# Altium schematic sheet MCU.SchDoc
size A4; SheetNumber: 2; SheetTotal: 8
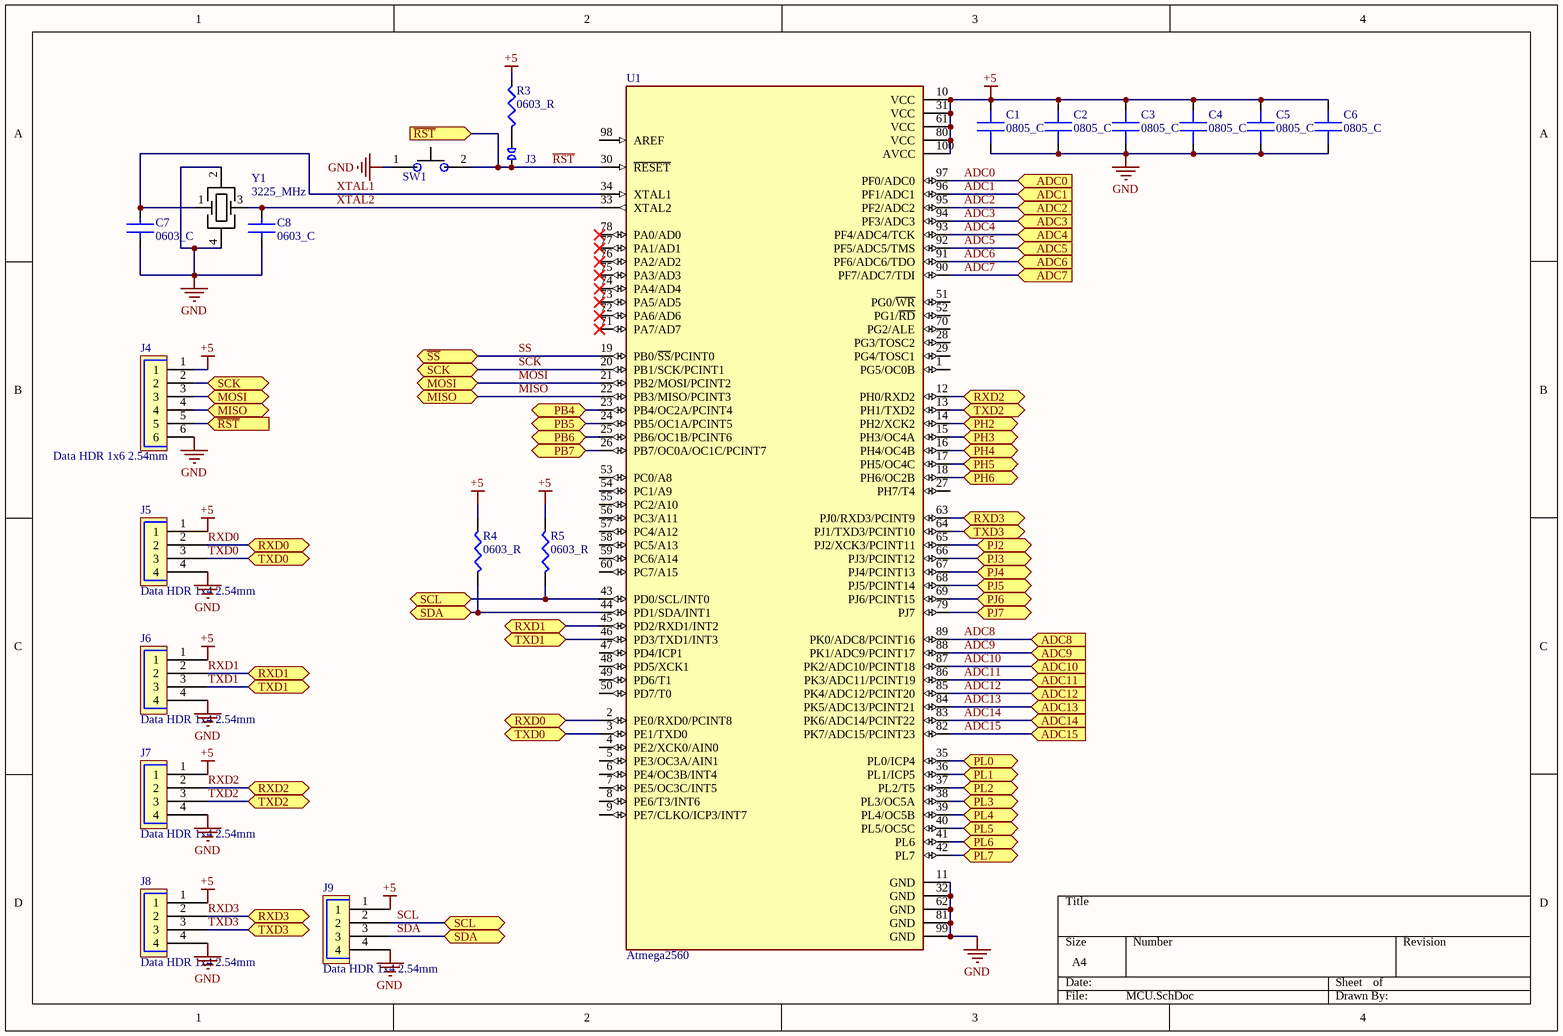
[diagram p0: MCU.SchDoc]

## Parts
C1  0805_C  [C0805 - 0.1uf]
C2  0805_C  [C0805 - 0.1uf]
C3  0805_C  [C0805 - 0.1uf]
C4  0805_C  [C0805 - 0.1uf]
C5  0805_C  [C0805 - 0.1uf]
C6  0805_C  [C0805 - 0.1uf]
C7  0603_C  [0603_CAP]
C8  0603_C  [0603_CAP]
J3  Jumper Pads  [JMP]  (value not drawn)
J4  Data HDR 1x6 2.54mm  [DHDR_1x6_2.54mm]
J5  Data HDR 1x4 2.54mm  [DHDR_1x4_2.54mm]
J6  Data HDR 1x4 2.54mm  [DHDR_1x4_2.54mm]
J7  Data HDR 1x4 2.54mm  [DHDR_1x4_2.54mm]
J8  Data HDR 1x4 2.54mm  [DHDR_1x4_2.54mm]
J9  Data HDR 1x4 2.54mm  [DHDR_1x4_2.54mm]
R3  0603_R  [0603_CAP]
R4  0603_R  [0603_CAP]
R5  0603_R  [0603_CAP]
SW1  2*3*4 SMD Button 2_Pads  [2padSMD- 2*3*4]  (value not drawn)
U1  Atmega2560  [QFP50P1600X1600X120-100N]
Y1  3225_MHz  [3225_Crystal]

## Ports
ADC0 (in), ADC1 (in), ADC2 (in), ADC3 (in), ADC4 (in), ADC5 (in), ADC6 (in), ADC7 (in), ADC8 (in), ADC9 (in), ADC10 (in), ADC11 (in), ADC12 (in), ADC13 (in), ADC14 (in), ADC15 (in), MISO (bidir), MOSI (bidir), PB4 (bidir), PB5 (bidir), PB6 (bidir), PB7 (bidir), PH2 (bidir), PH3 (bidir), PH4 (bidir), PH5 (bidir), PH6 (bidir), PJ2 (bidir), PJ3 (bidir), PJ4 (bidir), PJ5 (bidir), PJ6 (bidir), PJ7 (bidir), PL0 (bidir), PL1 (bidir), PL2 (bidir), PL3 (bidir), PL4 (bidir), PL5 (bidir), PL6 (bidir), PL7 (bidir), RXD0 (bidir), RXD1 (bidir), RXD2 (bidir), RXD3 (bidir), SCK (bidir), SCL (bidir), SDA (bidir), TXD0 (bidir), TXD1 (bidir), TXD2 (bidir), TXD3 (bidir), ~{RST} (in), ~{SS} (bidir)

## Nets
+5: C1.2 C2.2 C3.2 C4.2 C5.2 C6.2 J4.1 J5.1 J6.1 J7.1 J8.1 J9.1 R3.2 R4.2 R5.2 U1.10(VCC) U1.31(VCC) U1.61(VCC) U1.80(VCC) U1.100(AVCC)
GND: C1.1 C2.1 C3.1 C4.1 C5.1 C6.1 C7.1 C8.1 J4.6 J5.4 J6.4 J7.4 J8.4 J9.4 SW1.1 U1.11(GND) U1.32(GND) U1.62(GND) U1.81(GND) U1.99(GND) Y1.2 Y1.4
ADC0: U1.97(PF0/ADC0) ; port ADC0
ADC1: U1.96(PF1/ADC1) ; port ADC1
ADC2: U1.95(PF2/ADC2) ; port ADC2
ADC3: U1.94(PF3/ADC3) ; port ADC3
ADC4: U1.93(PF4/ADC4/TCK) ; port ADC4
ADC5: U1.92(PF5/ADC5/TMS) ; port ADC5
ADC6: U1.91(PF6/ADC6/TDO) ; port ADC6
ADC7: U1.90(PF7/ADC7/TDI) ; port ADC7
ADC8: U1.89(PK0/ADC8/PCINT16) ; port ADC8
ADC9: U1.88(PK1/ADC9/PCINT17) ; port ADC9
ADC10: U1.87(PK2/ADC10/PCINT18) ; port ADC10
ADC11: U1.86(PK3/ADC11/PCINT19) ; port ADC11
ADC12: U1.85(PK4/ADC12/PCINT20) ; port ADC12
ADC13: U1.84(PK5/ADC13/PCINT21) ; port ADC13
ADC14: U1.83(PK6/ADC14/PCINT22) ; port ADC14
ADC15: U1.82(PK7/ADC15/PCINT23) ; port ADC15
MISO: J4.4 U1.22(PB3/MISO/PCINT3) ; port MISO
MOSI: J4.3 U1.21(PB2/MOSI/PCINT2) ; port MOSI
PB4: U1.23(PB4/OC2A/PCINT4) ; port PB4
PB5: U1.24(PB5/OC1A/PCINT5) ; port PB5
PB6: U1.25(PB6/OC1B/PCINT6) ; port PB6
PB7: U1.26(PB7/OC0A/OC1C/PCINT7) ; port PB7
PH2: U1.14(PH2/XCK2) ; port PH2
PH3: U1.15(PH3/OC4A) ; port PH3
PH4: U1.16(PH4/OC4B) ; port PH4
PH5: U1.17(PH5/OC4C) ; port PH5
PH6: U1.18(PH6/OC2B) ; port PH6
PJ2: U1.65(PJ2/XCK3/PCINT11) ; port PJ2
PJ3: U1.66(PJ3/PCINT12) ; port PJ3
PJ4: U1.67(PJ4/PCINT13) ; port PJ4
PJ5: U1.68(PJ5/PCINT14) ; port PJ5
PJ6: U1.69(PJ6/PCINT15) ; port PJ6
PJ7: U1.79(PJ7) ; port PJ7
PL0: U1.35(PL0/ICP4) ; port PL0
PL1: U1.36(PL1/ICP5) ; port PL1
PL2: U1.37(PL2/T5) ; port PL2
PL3: U1.38(PL3/OC5A) ; port PL3
PL4: U1.39(PL4/OC5B) ; port PL4
PL5: U1.40(PL5/OC5C) ; port PL5
PL6: U1.41(PL6) ; port PL6
PL7: U1.42(PL7) ; port PL7
~{RST}: J3.1 J4.5 SW1.2 U1.30(~{RESET}) ; port ~{RST}
RXD0: J5.2 U1.2(PE0/RXD0/PCINT8) ; port RXD0
RXD1: J6.2 U1.45(PD2/RXD1/INT2) ; port RXD1
RXD2: J7.2 U1.12(PH0/RXD2) ; port RXD2
RXD3: J8.2 U1.63(PJ0/RXD3/PCINT9) ; port RXD3
SCK: J4.2 U1.20(PB1/SCK/PCINT1) ; port SCK
SCL: J9.2 R5.1 U1.43(PD0/SCL/INT0) ; port SCL
SDA: J9.3 R4.1 U1.44(PD1/SDA/INT1) ; port SDA
SS: U1.19(PB0/~{SS}/PCINT0) ; port ~{SS}
TXD0: J5.3 U1.3(PE1/TXD0) ; port TXD0
TXD1: J6.3 U1.46(PD3/TXD1/INT3) ; port TXD1
TXD2: J7.3 U1.13(PH1/TXD2) ; port TXD2
TXD3: J8.3 U1.64(PJ1/TXD3/PCINT10) ; port TXD3
XTAL1: C7.2 U1.34(XTAL1) Y1.1
XTAL2: C8.2 U1.33(XTAL2) Y1.3
NetJ3_2: J3.2 R3.1

Not connected (* = marked no-connect by the designer): U1 1(PG5/OC0B) 4(PE2/XCK0/AIN0) 5(PE3/OC3A/AIN1) 6(PE4/OC3B/INT4) 7(PE5/OC3C/INT5) 8(PE6/T3/INT6) 9(PE7/CLKO/ICP3/INT7) 27(PH7/T4) 28(PG3/TOSC2) 29(PG4/TOSC1) 47(PD4/ICP1) 48(PD5/XCK1) 49(PD6/T1) 50(PD7/T0) 51(PG0/~{WR}) 52(PG1/~{RD}) 53(PC0/A8) 54(PC1/A9) 55(PC2/A10) 56(PC3/A11) 57(PC4/A12) 58(PC5/A13) 59(PC6/A14) 60(PC7/A15) 70(PG2/ALE) 71(PA7/AD7)* 72(PA6/AD6)* 73(PA5/AD5)* 74(PA4/AD4)* 75(PA3/AD3)* 76(PA2/AD2)* 77(PA1/AD1)* 78(PA0/AD0)* 98(AREF)

## Library data of the parts
C1-C6 = 0805 Capacitor
C7 C8 = 0603 Capacitor
J4 = 6-Pin Data Connector: CONN HEADER VERT 6POS .100 TIN; Manufacturer 1: TE Connectivity; Manufacturer Part Number 1: 2-644861-6; Underplate Material: Nickel; Number of Contacts: 6; Connector Type: Plug,Header,Pin; Contact Resistance: 6mR; Mating Alignment: Yes (With); PCB Mount Retention: Without; PCB Mounting Orientation: Vertical; Parameter Name 1: Box; Voltage Rating: 250V; Current Rating: 5A; Backwall/Post Interruptions: No (Without); Connector System: Wire-to-Board; Plating Thickness: 6.3um; Contact Style: Straight; Contact Post Length: 3.56mm; PCB Thickness: 0.063inch; Approvals: CSA; Supplier 1: Digi-Key; Stock 1: 208; Pricing 1: 1=1.04000, 10=0.91900, 100=0.79250, 500=0.64840, 1000=0.57635, 5000=0.50431, 10000=0.47909 (USD); RoHS: Yes; Mount: Through Hole; Housing Material: Polyester; Contact Plating: Tin,Matte; Contact Material: Copper Alloy; Contact Shape: Square; Color: Black; Housing Color: Black; Min Operating Temperature: -67°C; Max Operating Temperature: 221°C; Number of Rows: 1; Termination: Solder; Contact Gender: Male; Package Quantity: 1000; Max Voltage Rating (AC): 250V; Fastening Type: Friction; Orientation: Straight; Number of Positions: 6; Contact Retention: No (Without); Mating Retention: Yes (With); PCB Mount Alignment: No (Without); Sealable: No (Without); Strain Relief: No (Without); Contact Current Rating: 5A; Length: 0.684inch; Height: 10.41mm; Pitch: 2.54mm; Contact Mating Length: 5.1mm; Depth: 7.95mm; Tail Length: 3.56mm; Radiation Hardening: No; Flammability Rating: UL94 V-0; REACH SVHC: Unknown; ComponentLink1URL: https://datasheet.ciiva.com/30493/0900766b80f915a1-30493314.pdf?src-supplier=RSComponents; ComponentLink1Description: https://datasheet.ciiva.com/30493/0900766b80f915a1-30493314.pdf?src-supplier=RSComponents; ComponentLink2URL: https://datasheet.ciiva.com/16303/2-644861-6-16303636.pdf?src-supplier=Future+Electronics; ComponentLink2Description: https://datasheet.ciiva.com/16303/2-644861-6-16303636.pdf?src-supplier=Future+Electronics; ComponentLink3URL: https://datasheet.ciiva.com/16684/eng-ds-82056-mta-0608-16684438.pdf?src-supplier=Avnet+Europe; ComponentLink3Description: https://datasheet.ciiva.com/16684/eng-ds-82056-mta-0608-16684438.pdf?src-supplier=Avnet+Europe; ComponentLink4URL: https://datasheet.ciiva.com/15175/getdatasheetpartid-36761-15175467.pdf?src-supplier=Verical; ComponentLink4Description: https://datasheet.ciiva.com/15175/getdatasheetpartid-36761-15175467.pdf?src-supplier=Verical; ComponentLink5URL: https://datasheet.ciiva.com/714/eng-cd-644861-n-basefilename-714750.pdf?src-supplier=Digi-Key; ComponentLink5Description: https://datasheet.ciiva.com/714/eng-cd-644861-n-basefilename-714750.pdf?src-supplier=Digi-Key; ComponentLink6URL: https://datasheet.ciiva.com/30135/8852eng-ds-82056-mta-0608-30135278.pdf?src-supplier=Onlinecomponents.com; ComponentLink6Description: https://datasheet.ciiva.com/30135/8852eng-ds-82056-mta-0608-30135278.pdf?src-supplier=Onlinecomponents.com; ComponentLink7URL: https://datasheet.ciiva.com/3118/eng-ds-82056-mta-0608-3118127.pdf?src-supplier=Avnet; ComponentLink7Description: https://datasheet.ciiva.com/3118/eng-ds-82056-mta-0608-3118127.pdf?src-supplier=Avnet; Supplier Part Number 1: A30935-ND
J5-J9 = 4-Pin Data Connector: MTA-100 Series, 2.54mm Pitch 4 Way 1 RowStraight PCB Header, Solder Term, 5A; Manufacturer 1: TE Connectivity; Manufacturer Part Number 1: 2-644861-4; Underplate Material: Nickel; Number of Contacts: 4; Connector Type: Plug,Header,Pin; Voltage Rating: 250V; Gender: Male; Shrouded: Yes (With); PCB Mount Retention: Without; PCB Mounting Orientation: Vertical; Contact Resistance: 6mR; Backwall/Post Interruptions: No (Without); Connector System: Wire-to-Board; Contact Post Length: 3.56mm; Plating Thickness: 6.35um; PCB Thickness: 0.063inch; Approvals: CSA; Supplier 1: Digi-Key; Stock 1: 18767; Pricing 1: 1=0.79000, 10=0.74100, 100=0.56790, 500=0.49380, 1000=0.40739, 5000=0.35801, 10000=0.33332 (USD); RoHS: Yes; Mount: Through Hole; Housing Color: Black; Color: Black; Contact Material: Copper Alloy; Contact Plating: Tin,Matte; Housing Material: Polyester; Contact Shape: Square; Min Operating Temperature: -67°C; Max Operating Temperature: 221°C; Termination: Solder; Number of Rows: 1; Contact Gender: Male; Number of Positions: 4; Package Quantity: 500; Packaging: Loose Piece; Current Rating: 5A; Voltage Rating (AC): 250V; Mating Alignment: Yes (With); Orientation: Straight; Fastening Type: Friction; Max Voltage Rating (AC): 250V; Contact Current Rating: 5A; Contact Retention: No (Without); Mating Retention: Yes (With); PCB Mount Alignment: No (Without); Sealable: No (Without); Strain Relief: No (Without); Contact Style: Straight; Length: 12.29mm; Height: 10.41mm; Pitch: 2.54mm; Contact Mating Length: 5.1mm; Depth: 7.95mm; Tail Length: 3.56mm; Radiation Hardening: No; Flammability Rating: UL94 V-0; ELV: Compliant; Lead Free: Lead Free; REACH SVHC: Unknown; ComponentLink1URL: https://datasheet.ciiva.com/7800/1651878-7800290.pdf?src-supplier=Element14; ComponentLink1Description: https://datasheet.ciiva.com/7800/1651878-7800290.pdf?src-supplier=Element14; ComponentLink2URL: https://datasheet.ciiva.com/15175/getdatasheetpartid-36841-15175492.pdf?src-supplier=Verical; ComponentLink2Description: https://datasheet.ciiva.com/15175/getdatasheetpartid-36841-15175492.pdf?src-supplier=Verical; ComponentLink3URL: https://datasheet.ciiva.com/11759/0900766b80f915a0-11759930.pdf?src-supplier=RSComponents; ComponentLink3Description: https://datasheet.ciiva.com/11759/0900766b80f915a0-11759930.pdf?src-supplier=RSComponents; ComponentLink4URL: https://datasheet.ciiva.com/714/eng-cd-644861-n-basefilename-714593.pdf?src-supplier=Digi-Key; ComponentLink4Description: https://datasheet.ciiva.com/714/eng-cd-644861-n-basefilename-714593.pdf?src-supplier=Digi-Key; ComponentLink5URL: https://datasheet.ciiva.com/16684/eng-ds-82056-mta-0608-16684709.pdf?src-supplier=Avnet+Europe; ComponentLink5Description: https://datasheet.ciiva.com/16684/eng-ds-82056-mta-0608-16684709.pdf?src-supplier=Avnet+Europe; ComponentLink6URL: https://datasheet.ciiva.com/16497/eng-ds-82056-mta-0608-16497871.pdf?src-supplier=Avnet+Asia; ComponentLink6Description: https://datasheet.ciiva.com/16497/eng-ds-82056-mta-0608-16497871.pdf?src-supplier=Avnet+Asia; Supplier Part Number 1: A30933-ND
R3-R5 = 0603 Resistor
U1 = ATmega2560-16AU: MP: ATmega2560-16AU; Package: None; Price: None; Value: *; Availability: Unavailable
Y1 = 3225_Crystal